# Altium schematic sheet heatbed.SchDoc: Detachable Heatbed
size A4; Author: Axel Colson; Organization: PXL; Revision: 1.0.0; SheetNumber: 1; SheetTotal: 1; Component: Hteabed; CreatedAt: 09/03/2024; LastUpdated: 05/03/2024; PartOf: Heatbed
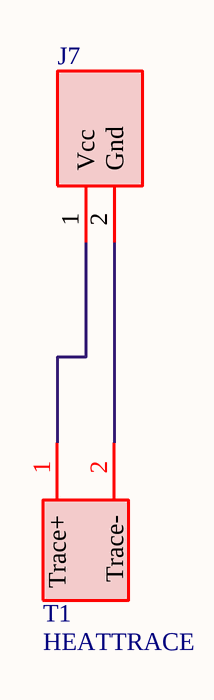
[diagram p0: heatbed.SchDoc]

## Parts
J7  CON_F1x2Pin  [CON_F1x2Pin]  (value not drawn)
T1  HEATTRACE  (mechanical)

## Nets
NetJ7_1: J7.1(Vcc) T1.1(Trace+)
NetJ7_2: J7.2(Gnd) T1.2(Trace-)

## Notes on the sheet
- Title
- Part of
- Component
- Creation date
- Revision
- Sheet
- Of
- Organisation
- Last updated
- Author

## Library data of the parts
J7 = CON_F1x2Pin: Connector; Manufacturer_Name: Adam Tech; Manufacturer_Part_Number: SMC-1-02-1-GT; Datasheet Link: https://app.adam-tech.com/products/download/data_sheet/203379/smc-1-xx-1-gt-data-sheet.pdf; Height: 4.381mm; Arrow Part Number: SMC-1-02-1-GT; Arrow Price/Stock: https://www.arrow.com/en/products/smc-1-02-1-gt/adam-tech